# EAGLE design DIYTIL311_v1.2 (EAGLE 9.4.2)
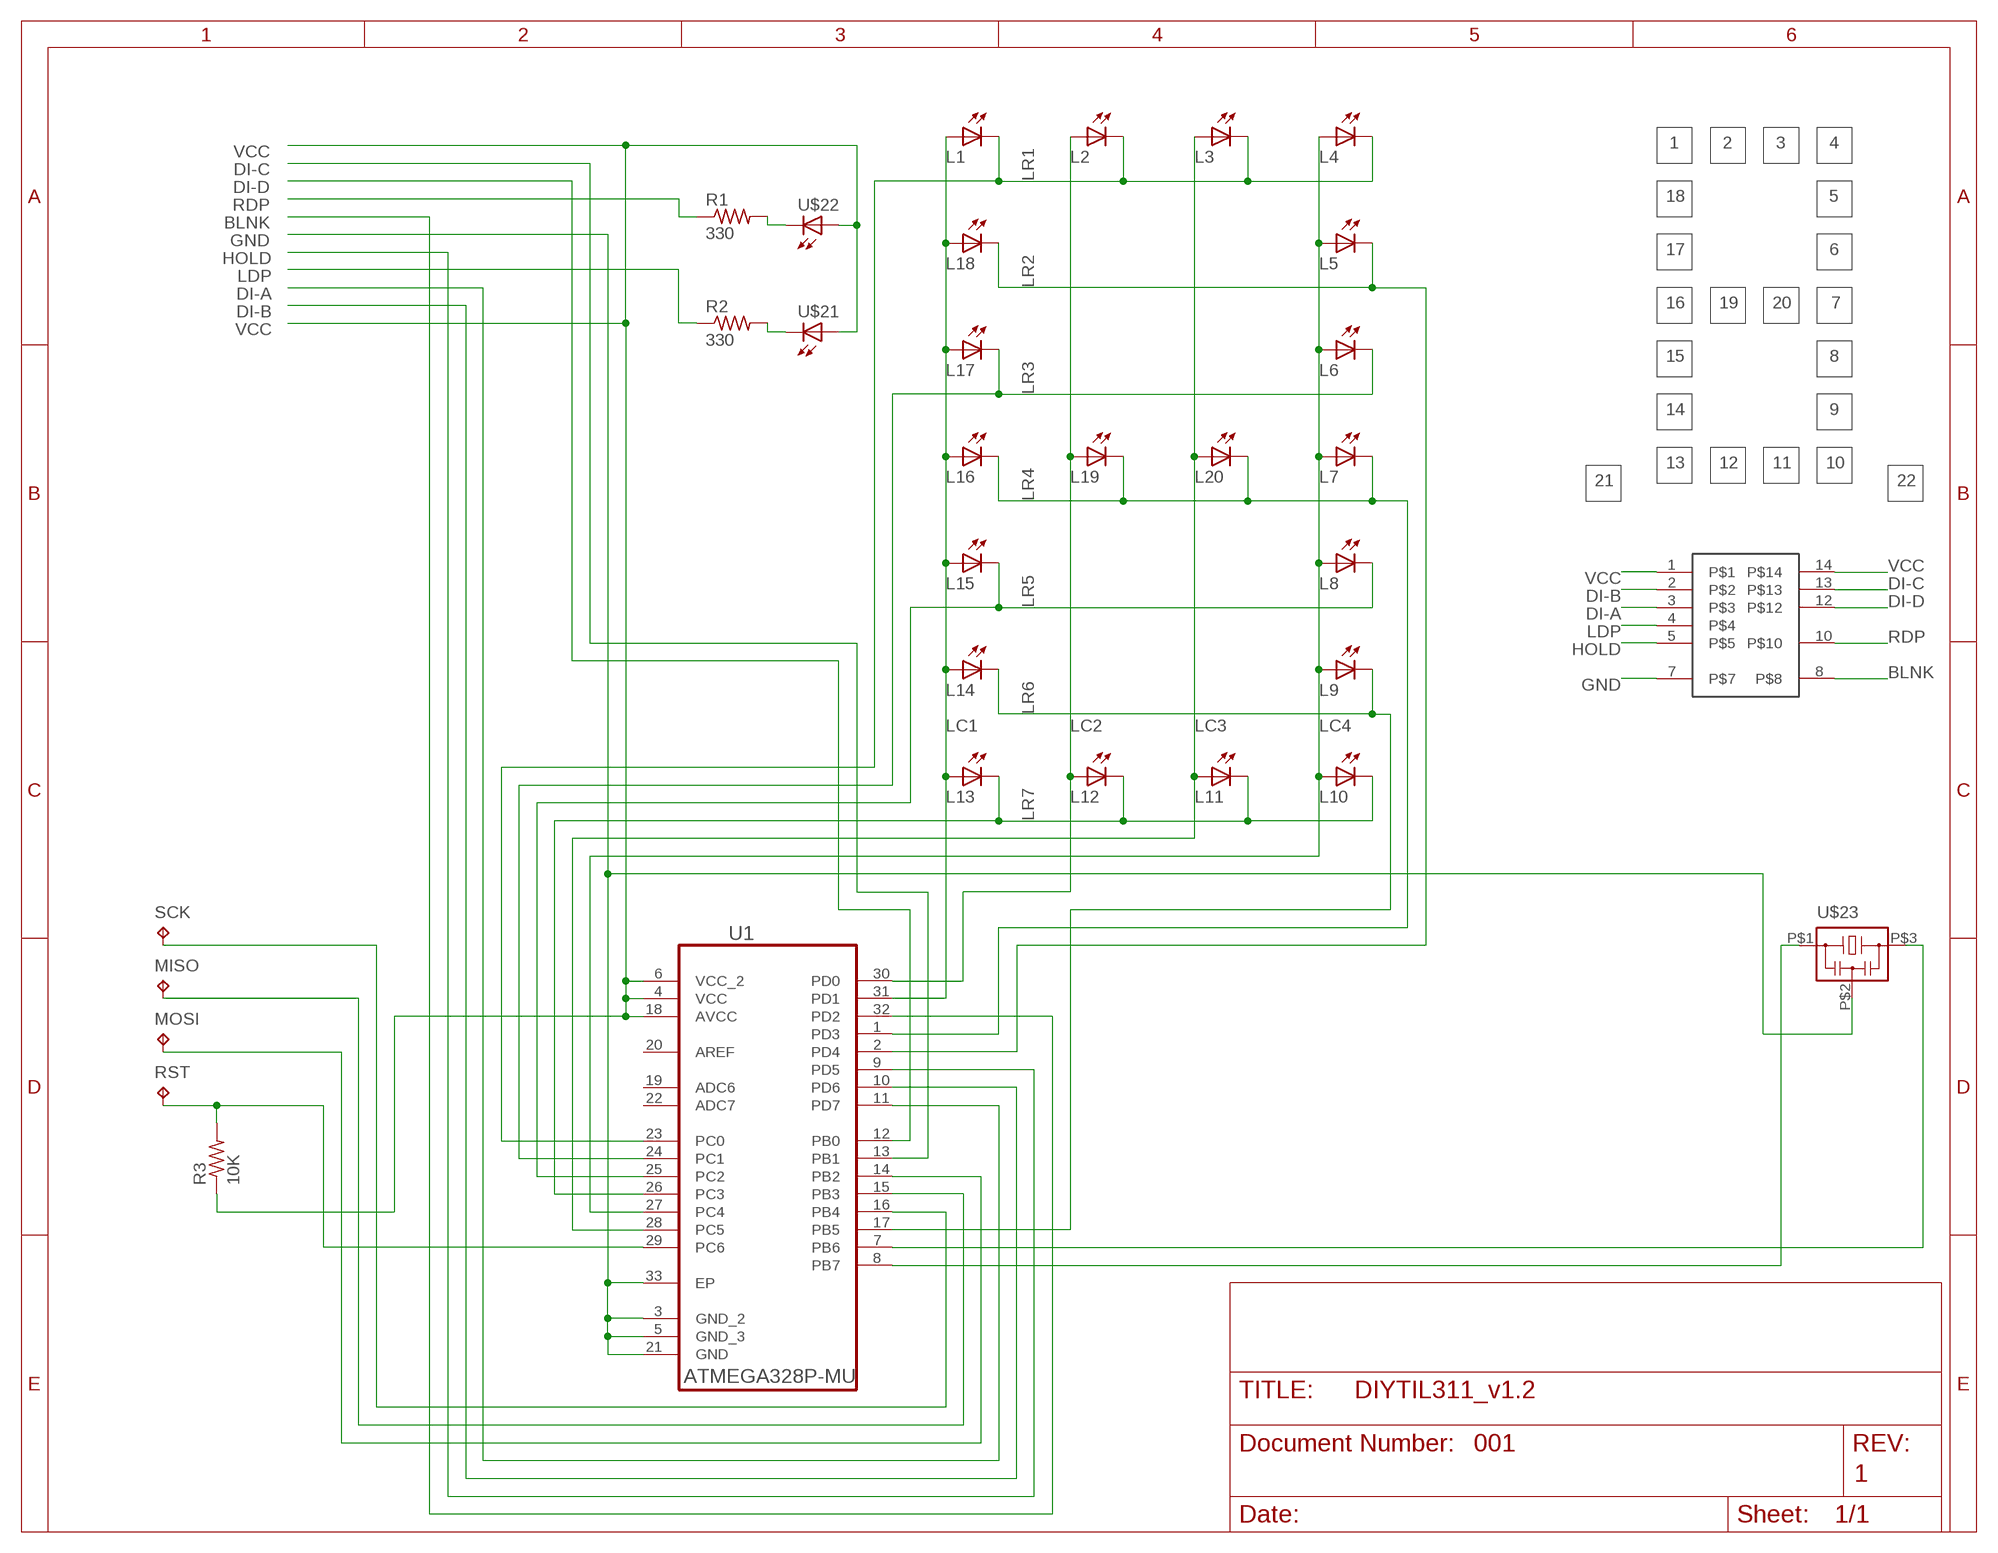
[diagram p0: schematic, sheet 1]

## Parts
L1  0201.LED0201  [LEDC0603X33]
L2  0201.LED0201  [LEDC0603X33]
L3  0201.LED0201  [LEDC0603X33]
L4  0201.LED0201  [LEDC0603X33]
L5  0201.LED0201  [LEDC0603X33]
L6  0201.LED0201  [LEDC0603X33]
L7  0201.LED0201  [LEDC0603X33]
L8  0201.LED0201  [LEDC0603X33]
L9  0201.LED0201  [LEDC0603X33]
L10  0201.LED0201  [LEDC0603X33]
L11  0201.LED0201  [LEDC0603X33]
L12  0201.LED0201  [LEDC0603X33]
L13  0201.LED0201  [LEDC0603X33]
L14  0201.LED0201  [LEDC0603X33]
L15  0201.LED0201  [LEDC0603X33]
L16  0201.LED0201  [LEDC0603X33]
L17  0201.LED0201  [LEDC0603X33]
L18  0201.LED0201  [LEDC0603X33]
L19  0201.LED0201  [LEDC0603X33]
L20  0201.LED0201  [LEDC0603X33]
MISO  TPB1,27  [B1,27]
MOSI  TPB1,27  [B1,27]
R1  330  R-US_R0201  [R0201]
R2  330  R-US_R0201  [R0201]
R3  10K  R-US_R0201  [R0201]
RST  TPB1,27  [B1,27]
SCK  TPB1,27  [B1,27]
U1  ATMEGA328P-MU  [QFN50P500X500X100-33N]
U$21  0201.LED0201  [LEDC0603X33]
U$22  0201.LED0201  [LEDC0603X33]
U$23  CSTNE16M0V53Z000R0  [MFF]
U$24  TIL311DIP  [TIL311DIP_FOOTPRINT]

## Nets
BLNK: U1.32(PD2) U$24.8
DI-A: U1.11(PD7) U$24.3
DI-B: U1.10(PD6) U$24.2
DI-C: U1.13(PB1) U$24.13
DI-D: U1.12(PB0) U$24.12
GND [ground]: U1.3(GND_2) U1.5(GND_3) U1.21(GND) U1.33(EP) U$23.P$2 U$24.7
HOLD: U1.9(PD5) U$24.5
LC1: L1.1(A) L13.1(A) L14.1(A) L15.1(A) L16.1(A) L17.1(A) L18.1(A) U1.31(PD1)
LC2: L2.1(A) L12.1(A) L19.1(A) U1.30(PD0)
LC3: L3.1(A) L11.1(A) L20.1(A) U1.28(PC5)
LC4: L4.1(A) L5.1(A) L6.1(A) L7.1(A) L8.1(A) L9.1(A) L10.1(A) U1.27(PC4)
LDP: R2.1 U$24.4
LR1: L1.2(C) L2.2(C) L3.2(C) L4.2(C) U1.23(PC0)
LR2: L5.2(C) L18.2(C) U1.2(PD4)
LR3: L6.2(C) L17.2(C) U1.24(PC1)
LR4: L7.2(C) L16.2(C) L19.2(C) L20.2(C) U1.1(PD3)
LR5: L8.2(C) L15.2(C) U1.25(PC2)
LR6: L9.2(C) L14.2(C) U1.17(PB5)
LR7: L10.2(C) L11.2(C) L12.2(C) L13.2(C) U1.26(PC3)
MISO: MISO.TP U1.15(PB3)
MOSI: MOSI.TP U1.14(PB2)
N$1: R1.2 U$22.2(C)
N$2: R2.2 U$21.2(C)
RDP: R1.1 U$24.10
RES1: U1.8(PB7) U$23.P$1
RES2: U1.7(PB6) U$23.P$3
RST: R3.2 RST.TP U1.29(PC6)
SCK: SCK.TP U1.16(PB4)
VCC: R3.1 U1.4(VCC) U1.6(VCC_2) U1.18(AVCC) U$21.1(A) U$22.1(A) U$24.1 U$24.14
Unconnected: U1.19(ADC6) U1.20(AREF) U1.22(ADC7)

## Notes on the sheet
- 1 | 2 | 3 | 4
- 18 | 5
- 17 | 6
- 16 | 19 | 20 | 7
- 15 | 8
- 14 | 9
- 13 | 12 | 11 | 10
- 21 | 22
- 001
- 1

## Library data of the parts
L1-L20 U$21 U$22 = FUCK,_no_one_makes_is_so_I_might_as_well...:0201.LED: No one made a 0201 smd LED, so I made one.
MISO MOSI RST SCK = testpad:TP: Test pad
R1-R3 = rcl:R-US_: RESISTOR, American symbol; SPICEPREFIX: R
U1 = Atmel_By_element14_Batch_1-00:ATMEGA328P-MU: Programmable Flash; MPN: ATMEGA328P-MU; OC_FARNELL: 1748522; OC_NEWARK: 26R2526; PACKAGE: QFN-32; SUPPLIER: Atmel
U$23 = FUCK,_no_one_makes_is_so_I_might_as_well...:CSTNE16M0V53Z000R0
U$24 = FUCK,_no_one_makes_is_so_I_might_as_well...:TIL311DIP

## Net classes
0 default: width 0.089 mm, clearance 0.089 mm
1 ground: width 0.089 mm

## Board
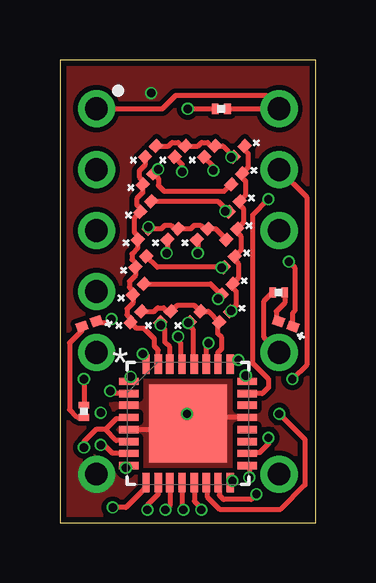
[diagram p1: board, top side]
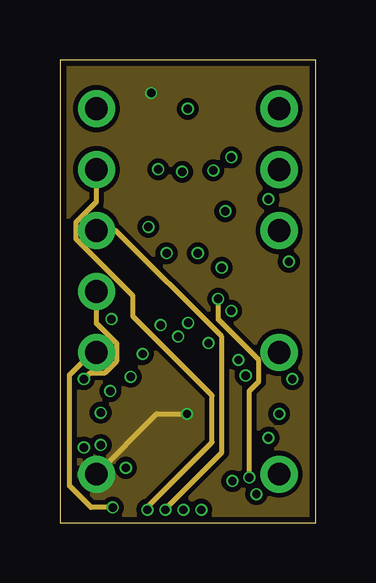
[diagram p2: board, inner layer Route2]
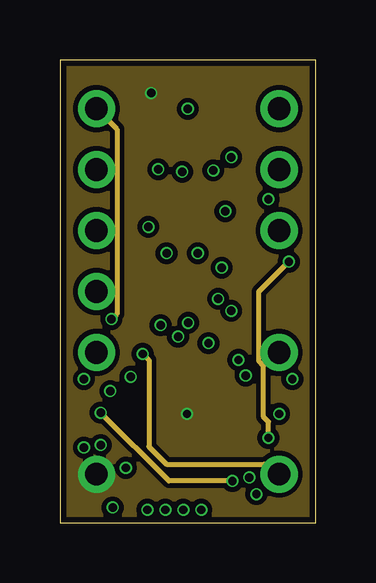
[diagram p3: board, inner layer Route15]
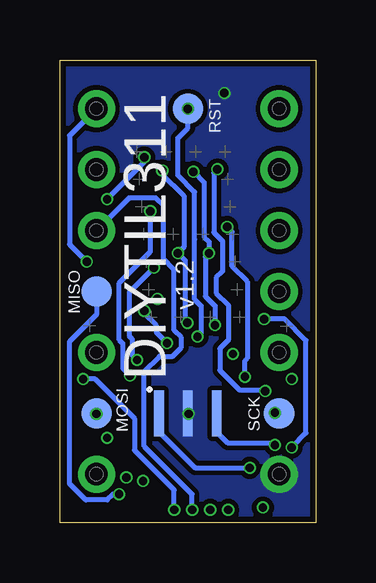
[diagram p4: board, bottom side, seen from below]

Size 10.67 x 19.31 mm. Coordinates in mm from the lower left corner, seen from the top.
Outline: 0,0 10.67,0 10.67,19.31 0,19.31 0,0
Copper layers (1+2*15+16): Top 0.035mm / dielectric 1.5mm / Route2 0.035mm / dielectric 0.15mm / Route15 0.035mm / dielectric 0.2mm / Bottom 0.035mm
Design rules "JLCPCB_2_Layer *": minimum track width 0.2mm, minimum drill 0.3mm, track to track 0.2mm, track to pad 0.2mm, pad to pad 0.2mm, via to via 0.2mm, smd to smd 0mil, copper to edge 10mil, drill to drill 6mil, minimum pad ring 3mil, minimum via ring 3mil, stop-mask expansion 4mil, vias tented up to drill 0mil, thermal gap 0mil

### Footprints (pad centres in the part's own frame; a part is rotated, then mirrored left to right if it is on the bottom)
LEDC0603X33 = smd 0.455 x 0.397: 1 -0.321,0; 2 0.321,0
B1,27 = smd 1.27 x 1.27: TP 0,0
R0201 = smd 0.28 x 0.43: 1 -0.255,0; 2 0.255,0
QFN50P500X500X100-33N = smd 0.813 x 0.305: 1 -2.464,1.753; 2 -2.464,1.245; 3 -2.464,0.762; 4 -2.464,0.254; 5 -2.464,-0.254; 6 -2.464,-0.762; 7 -2.464,-1.245; 8 -2.464,-1.753; 17 2.464,-1.753; 18 2.464,-1.245; 19 2.464,-0.762; 20 2.464,-0.254; 21 2.464,0.254; 22 2.464,0.762; 23 2.464,1.245; 24 2.464,1.753 | smd 0.305 x 0.813: 9 -1.753,-2.464; 10 -1.245,-2.464; 11 -0.762,-2.464; 12 -0.254,-2.464; 13 0.254,-2.464; 14 0.762,-2.464; 15 1.245,-2.464; 16 1.753,-2.464; 25 1.753,2.464; 26 1.245,2.464; 27 0.762,2.464; 28 0.254,2.464; 29 -0.254,2.464; 30 -0.762,2.464; 31 -1.245,2.464; 32 -1.753,2.464 | smd 3.251 x 3.251: 33 0,0
MFF = smd 0.4 x 1.9: P$1 -1.2,0; P$2 0,0; P$3 1.2,0
TIL311DIP_FOOTPRINT = drill 0.95 pad 1.55: 1 -3.81,7.62; 2 -3.81,5.08; 3 -3.81,2.54; 4 -3.81,0; 5 -3.81,-2.54; 7 -3.81,-7.62; 8 3.81,-7.62; 10 3.81,-2.54; 12 3.81,2.54; 13 3.81,5.08; 14 3.81,7.62

### Placement (x,y rotation side)
L1  3.78,15.49 45 top
L2  5.01,15.49 45 top
L3  6.24,15.49 45 top
L4  7.47,15.49 225 top
L5  7.37,14.35 225 top
L6  7.27,13.2 225 top
L7  7.17,12.04 225 top
L8  7.07,10.9 225 top
L9  6.97,9.74 225 top
L10  6.87,8.6 225 top
L11  5.64,8.6 45 top
L12  4.41,8.6 45 top
L13  3.17,8.6 45 top
L14  3.28,9.74 45 top
L15  3.38,10.9 45 top
L16  3.48,12.04 45 top
L17  3.58,13.2 45 top
L18  3.68,14.35 45 top
L19  4.71,12.04 45 top
L20  5.94,12.04 45 top
MISO  9.14,9.65 0 bottom
MOSI  9.14,4.57 0 bottom
R1  9.12,9.61 0 top
R2  1,4.66 270 top
R3  6.73,17.27 180 top
RST  5.33,17.27 0 bottom
SCK  1.52,4.57 0 bottom
U1  5.35,4.15 0 top
U$21  1.23,8.3 200 top
U$22  9.43,8.3 160 top
U$23  5.33,4.57 0 bottom
U$24  5.33,9.65 0 top

### Tracks (layer width: path | path; a pad name or v marks a point on that pad's centre or on a via)
BLNK  (via drill 0.35)
  Top 0.2: U1.32 3.55,6.66 3.55,6.95 v3.45,7.05
  Route15 0.2: v3.45,7.05 3.71,6.79 3.71,3.18 4.44,2.45 8.53,2.45 8.95,2.04 U$24.8
DI-A  (via drill 0.35)
  Top 0.2: U1.11 4.58,0.73 v4.4,0.55
  Route2 0.2: v4.4,0.55 4.4,0.59 6.75,2.94 6.75,7.77 2.33,12.2 U$24.3
DI-B  (via drill 0.35)
  Top 0.2: U1.10 4.1,1.2 3.65,0.75 v3.65,0.55
  Route2 0.2: v3.65,0.55 3.65,0.67 6.35,3.37 6.35,5.32 3.05,8.62 3.05,9.47 0.67,11.84 0.67,12.55 1.52,13.4 U$24.2
DI-C  (via drill 0.35)
  Top 0.2: v9.7,6 10.32,6.62 10.32,13.56 U$24.13 | U1.13 5.61,0.91 5.9,0.61 v5.9,0.55
  Bottom 0.2: v5.9,0.55 5.9,1.38 7.56,3.04 7.56,4.36 9.2,6 v9.7,6
DI-D  (via drill 0.35)
  Top 0.2: U1.12 5.09,0.61 v5.15,0.55
  Bottom 0.2: v5.15,0.55 5.15,1.2 7.15,3.2 7.15,6.32 6.52,6.95 5.97,6.95 5.6,7.32 5.6,7.73 5.9,8.03 5.9,10.58 6.35,11.03 6.35,13.23 6.67,13.55 7.79,13.55 U$24.12
GND  (via drill 0.35)
  Top 0.2: U1.5 5.09,3.9 U1.33 | U1.21 5.45,4.4 v5.3,4.55
  Route2 0.2: U$24.7 4.04,4.55 v5.3,4.55
  Bottom 0.2: U$23.P$2 5.31,4.55 v5.3,4.55
  other vias: 3.81,17.93
  pour Top: 0,0 10.67,0 10.67,19.31 0,19.31
  pour Bottom: 0,0 10.67,0 10.67,19.31 0,19.31
  pour Route15: 0,0 10.67,0 10.67,19.31 0,19.31
  pour Route2: 0,0 10.67,0 10.67,19.31 0,19.31
HOLD  (via drill 0.35)
  Top 0.2: U1.9 3.59,1.49 2.76,0.65 v2.2,0.65
  Route2 0.2: v2.2,0.65 1.3,0.65 0.4,1.55 0.4,6.18 1.33,7.12 U$24.5
LC1
  Top 0.2: L1.1 3.55,14.92 3.3,14.68 3.3,14.43 3.45,14.28 L18.1 3.45,13.77 3.2,13.53 3.2,13.28 3.35,13.13 L17.1 3.1,12.72 3.1,12.13 3.25,11.98 L16.1 3.25,11.47 3,11.23 3,10.98 3.15,10.83 L15.1 3.15,10.32 2.9,10.08 2.9,9.83 3.05,9.68 L14.1 3.05,9.17 2.8,8.93 2.8,8.68 2.95,8.53 L13.1 3.2,8.12 3.51,8.12 3.95,7.68 3.95,7.37 4.1,7.21 U1.31
LC2  (via drill 0.35)
  Top 0.2: v5.1,14.65 5.1,14.95 L2.1 | U1.30 4.58,7.33 4.38,7.54 4.38,8.07 v4.2,8.25 4.18,8.27 L12.1 | L19.1 4.48,11.28 v4.45,11.25
  Bottom 0.2: v5.1,14.65 4.65,14.2 4.65,11.93 4.45,11.73 v4.45,11.25 4.6,11.1 4.6,9.45 4.2,9.05 v4.2,8.25
LC3  (via drill 0.35)
  Top 0.2: L3.1 6.4,14.88 v6.4,14.7 | L20.1 5.75,11.78 v5.75,11.25 | U1.28 5.54,6.67 5.54,8.08 5.41,8.22 L11.1 5.37,8.37 v5.35,8.35
  Bottom 0.2: v6.4,14.7 6.4,14.55 5.5,13.65 5.5,11.5 v5.75,11.25 5.45,10.95 5.45,8.45 v5.35,8.35
LC4  (via drill 0.35)
  Top 0.2: L4.1 7.7,15.56 7.85,15.41 7.85,14.82 L5.1 7.6,14.41 7.75,14.26 7.75,13.67 L6.1 7.5,13.26 7.65,13.11 7.65,12.52 L7.1 7.4,12.11 7.55,11.96 7.55,11.37 L8.1 7.3,10.96 7.44,10.81 7.44,10.22 L9.1 7.2,9.81 7.35,9.66 7.35,9.07 L10.1 7.12,8.82 v7.15,8.85 | U1.27 6.11,7.41 v6.2,7.5
  Bottom 0.2: v6.2,7.5 6.65,7.95 6.65,8.23 7.15,8.73 v7.15,8.85
LDP  (via drill 0.35)
  Top 0.2: v1,6 R2.1
  Route2 0.2: v1,6 1.26,6.26 1.88,6.26 2.38,6.76 2.38,7.47 1.52,8.32 U$24.4
LR1  (via drill 0.35)
  Top 0.2: L1.2 4.53,15.72 4.68,15.87 4.93,15.87 5.08,15.72 L2.2 5.76,15.72 5.91,15.87 6.16,15.87 6.31,15.72 L3.2 6.79,15.72 L4.2 7.23,15.25 v7.15,15.25 | U1.23 8.45,5.39 8.7,5.65 8.7,6 8.05,6.65 8.05,12.85 v8.7,13.5
  Bottom 0.2: v8.7,13.5 7.15,15.05 v7.15,15.25
LR2  (via drill 0.35)
  Top 0.2: L5.2 6.85,13.82 4.36,13.82 4.11,14.07 4.11,14.37 L18.2 3.92,14.57 v4.1,14.75 | U1.2 2.21,5.39 v2.1,5.5
  Bottom 0.2: v4.1,14.75 4.25,14.6 4.25,12.12 3.88,11.75 3.88,10.49 4.15,10.23 4.15,9.6 3.65,9.1 3.65,7.63 4,7.28 4,6.37 3.18,5.55 2.15,5.55 v2.1,5.5
LR3  (via drill 0.35)
  Top 0.2: L17.2 6.59,13.42 L6.2 7.01,13 v6.9,13 | U1.24 7.75,5.96 v7.75,6.15
  Bottom 0.2: v6.9,13 6.9,11.3 8.2,10 8.2,7.64 8.05,7.49 8.05,6.45 v7.75,6.15
LR4  (via drill 0.35)
  Top 0.2: L7.2 6.49,12.27 L20.2 6.01,12.27 5.86,12.42 5.61,12.42 5.46,12.27 L19.2 4.77,12.27 4.63,12.42 4.38,12.42 4.23,12.27 L16.2 3.7,12.34 v3.69,12.35 | v2.95,6.1 2.95,6.05 U1.1
  Bottom 0.2: v2.95,6.1 2.95,6.77 2.85,6.87 2.85,10.07 3.48,10.7 3.48,12.14 v3.69,12.35
LR5  (via drill 0.35)
  Top 0.2: L8.2 | U1.25 7.29,6.8 v7.45,6.8 | L8.2 4.06,10.67 L15.2 | L8.2 6.83,10.65 v6.75,10.65
  Bottom 0.2: v7.45,6.8 7.65,7 7.65,7.67 7.78,7.8 7.78,9.62 v6.75,10.65
LR6  (via drill 0.35)
  Top 0.2: 3.6,10 3.57,9.97 L14.2 6.29,9.97 L9.2 6.75,9.49 v6.6,9.35 | U1.17 7.86,2.4 7.9,2.36 v7.9,1.9
  Route2 0.2: v7.9,1.9 7.9,5.5 8.3,5.9 8.3,6.8 6.6,8.5 v6.6,9.35
LR7
  Top 0.2: L13.2 3.93,8.82 4.08,8.97 4.33,8.97 4.47,8.82 L12.2 4.88,9.07 5.62,9.07 L11.2 6.19,8.82 L10.2 6.59,8.31 6.59,7.89 6.75,7.73 6.75,7.27 6.59,7.11 U1.26
MISO  (via drill 0.35)
  Top 0.2: U1.15 6.65,1.63 6.65,1.16 6.82,0.98 7.98,0.98 v8.2,1.2
  Bottom 0.2: MISO.TP 9.14,8.69 10.27,7.56 10.27,1.64 9.59,0.96 8.7,0.96 8.46,1.2 v8.2,1.2
MOSI  (via drill 0.35)
  Top 0.2: v9.15,4.55 10.22,3.48 10.22,1.59 9.21,0.58 6.66,0.58 6.14,1.1 6.14,1.66 U1.14
  Bottom 0.2: MOSI.TP v9.15,4.55
N$1
  Top 0.2: R1.2 9.38,9.18 9.02,8.82 9.02,8.51 U$22.2
N$2
  Top 0.2: U$21.2 0.92,8.03 0.4,7.51 0.4,4.73 0.73,4.41 R2.2
RDP
  Top 0.2: R1.1 8.52,9.26 8.52,7.74 U$24.10
RES1  (via drill 0.35)
  Top 0.2: U1.8 2.84,2.39 v2.75,2.3
  Bottom 0.2: U$23.P$1 6.53,3.8 5.04,2.3 v2.75,2.3
RES2  (via drill 0.35)
  Top 0.2: U1.7 2.19,2.9 1.85,3.25 v1.7,3.25
  Bottom 0.2: v1.7,3.25 1.8,3.35 3.67,3.35 4.13,3.81 U$23.P$3
RST  (via drill 0.35)
  Top 0.2: v4.93,7.77 4.93,7.6 5.04,7.49 5.04,6.67 U1.29 | RST.TP R3.2
  Bottom 0.2: v4.93,7.77 4.78,7.92 4.78,9.06 5.05,9.33 5.05,11.83 5.05,13.8 5.75,14.5 5.75,16.06 5.33,16.47 RST.TP | RST.TP 5.31,17.25 RST.TP
  other vias: 5.33,17.27
SCK  (via drill 0.35)
  Top 0.2: U1.16 7.13,1.75 v7.2,1.75
  Route15 0.2: v7.2,1.75 4.55,1.75 v1.7,4.6
  Bottom 0.2: v1.7,4.6 1.55,4.6 SCK.TP
VCC  (via drill 0.35)
  Top 0.2: U$22.1 9.73,8.77 9.82,8.87 9.82,10.63 v9.55,10.9 | U1.6 2.83,3.44 2.35,3.44 1.9,3.9 | U1.4 2.83,4.35 2.35,4.35 1.9,3.9 | v1,3.15 1,3.4 1.5,3.9 1.9,3.9 | U$24.1 4.28,17.27 4.83,17.82 8.6,17.82 U$24.14 R3.1 | U$21.1 1.59,8.35 1.9,8.35 2.05,8.5 v2.15,8.5 | U1.18 7.84,2.94 8.34,2.94 8.7,3.29 v8.7,3.55
  Route15 0.2: v8.7,3.55 8.7,4.22 8.5,4.42 8.5,6.56 8.29,6.76 8.29,9.64 v9.55,10.9 | v2.15,8.5 2.38,8.73 2.38,16.42 U$24.1
  Bottom 0.2: U$24.14 10.27,16.15 10.27,11.62 v9.55,10.9 | v1,3.15 0.4,3.75 0.4,7.62 1.28,8.5 v2.15,8.5

### Text on the board
bPlace: v1.2 | DIYTIL311